# EAGLE design WiFi_Switch (EAGLE 9.3.1)
The Schematis for the WiFi Switch project.
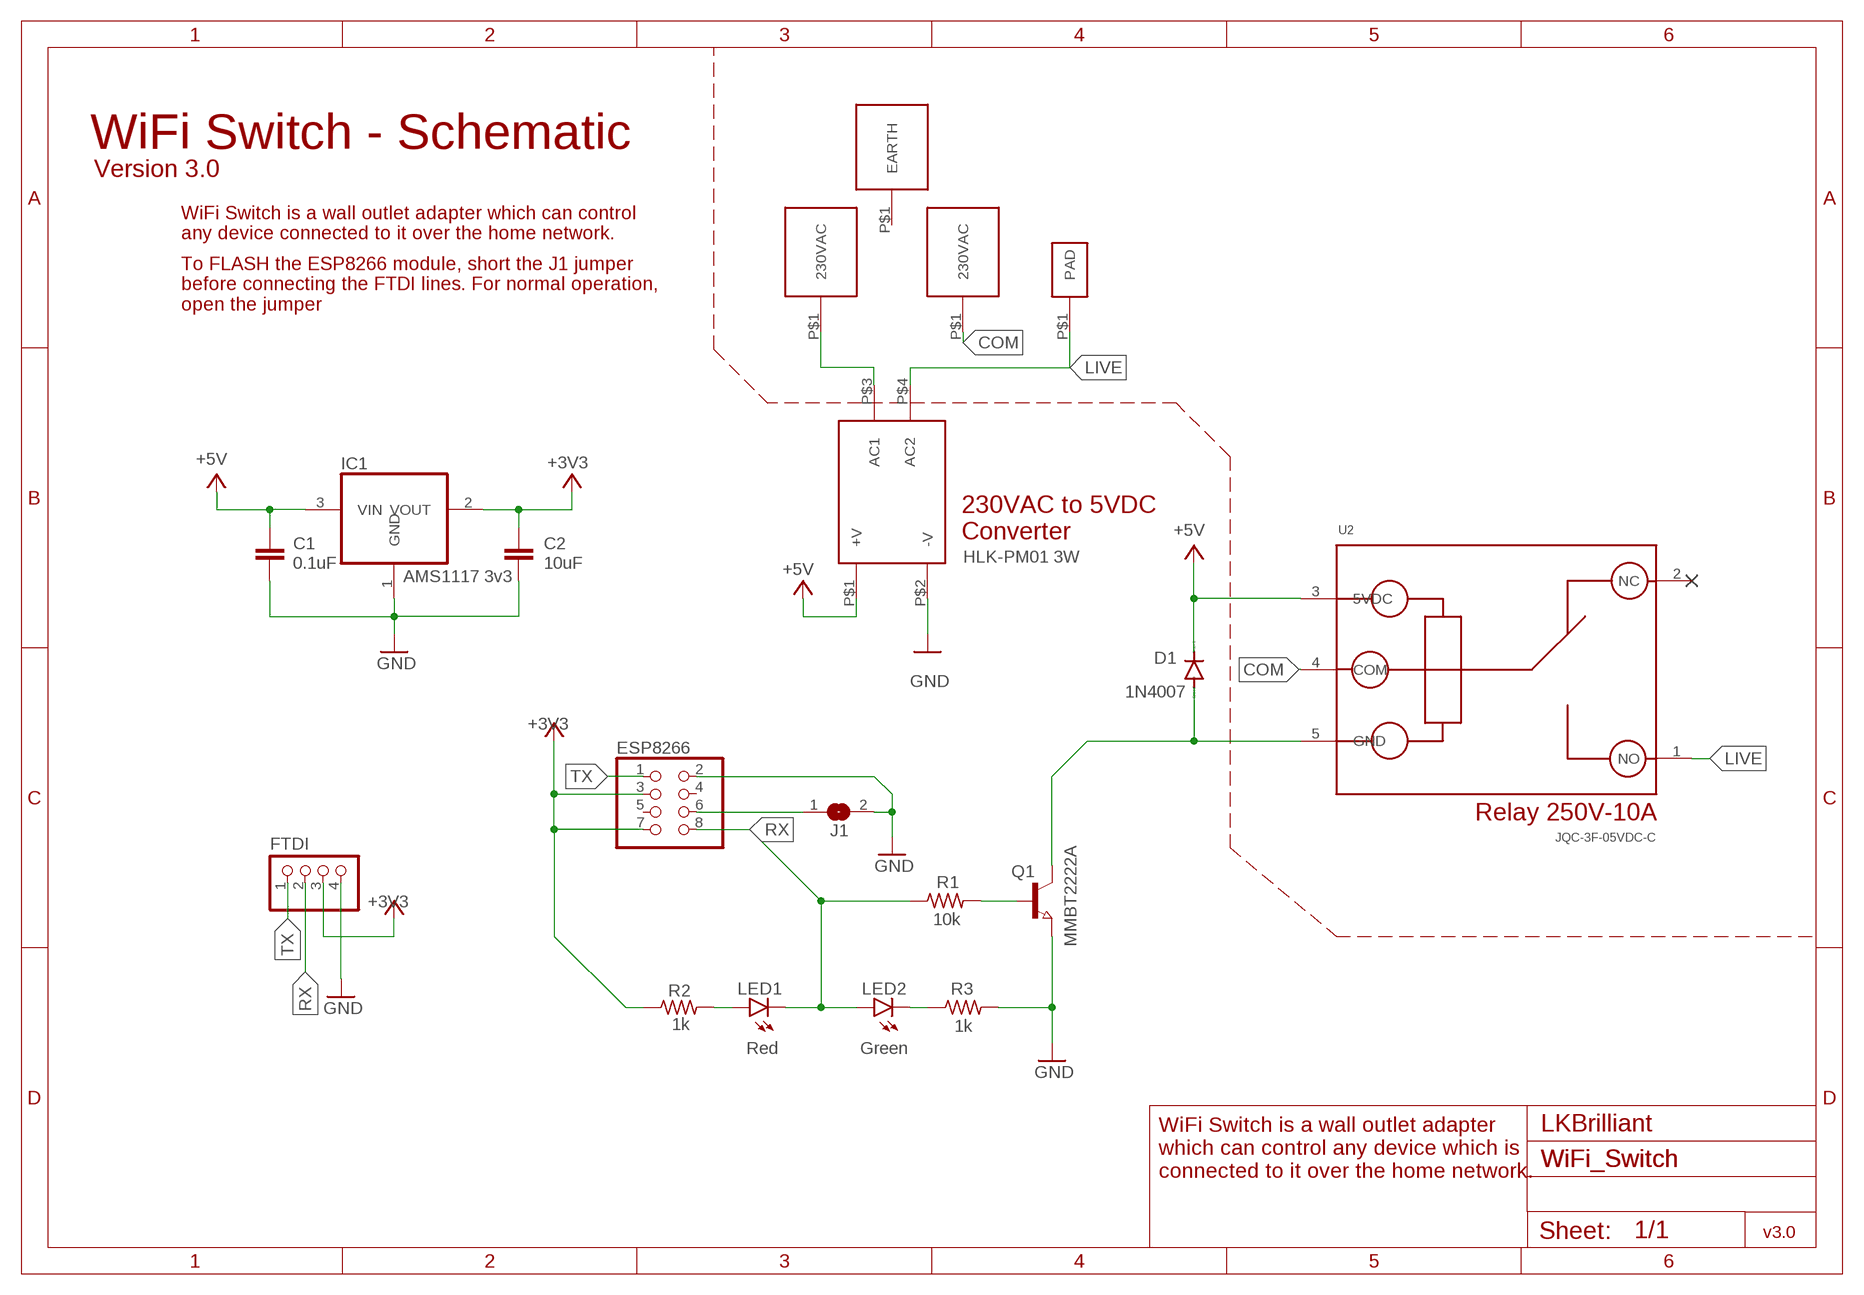
[diagram p0: schematic, sheet 1]

## Parts
C1  0.1uF  C-EUC0805  [C0805]
C2  10uF  C-EUC0805  [C0805]
D1  1N4007  DIODE-DO214AC  [DO214AC]
ESP8266  PINHD-2X4  [2X04]
FTDI  PINHD-1X4  [1X04]
IC1  AMS1117 3v3  REG1117  [SOT223]
J1  SJ  [SJ]
L  230VAC_PAD  [11X9_SMD_PAD]
LED1  Red  LEDCHIPLED_0603  [CHIPLED_0603]
LED2  Green  LEDCHIPLED_0603  [CHIPLED_0603]
N  230VAC_PAD  [11X9_SMD_PAD]
Q1  MMBT2222A  NPN-TRANSISTOR_SOT23  [SOT23]
R1  10k  R-US_R0805  [R0805]
R2  1k  R-US_R0805  [R0805]
R3  1k  R-US_R0805  [R0805]
U1  230VAC/5VDC_CONVERTER  [REG_BLOCK]
U2  JQC-3F-05VDC-C  RELAY-JQC-3F  [JQC-3F]
U$4  EARTH_PAD  [17X8_PAD]
U$5  EXT_PAD  [4X2_PAD]

## Nets
+3V3: C2.1 ESP8266.3 ESP8266.7 FTDI.3 IC1.2(VOUT) R2.1
+5V: C1.1 D1.C IC1.3(VIN) U1.P$1(+V) U2.3(5VDC)
COM: L.P$1(230VAC) U2.4(COM)
GND: C1.2 C2.2 ESP8266.2 FTDI.4 IC1.1(GND) J1.2 Q1.2(E) R3.2 U1.P$2(-V)
LIVE: U1.P$4(AC2) U2.1(NO) U$5.P$1(PAD)
N$1: LED1.A R2.2
N$2: N.P$1(230VAC) U1.P$3(AC1)
N$3: ESP8266.6 J1.1
N$5: D1.A Q1.3(C) U2.5(GND)
N$6: LED2.C R3.1
N$7: Q1.1(B) R1.2
RX: ESP8266.8 FTDI.2 LED1.C LED2.A R1.1
TX: ESP8266.1 FTDI.1
Unconnected: ESP8266.4 ESP8266.5 U2.2(NC) U$4.P$1(EARTH)

## Notes on the sheet
- WiFi Switch - Schematic
- Version 3.0
- WiFi Switch is a wall outlet adapter which can control
  any device connected to it over the home network.
- To FLASH the ESP8266 module, short the J1 jumper
  before connecting the FTDI lines. For normal operation,
  open the jumper
- 230VAC to 5VDC 
  Converter
- HLK-PM01 3W
- Relay 250V-10A
- LKBrilliant
- WiFi Switch is a wall outlet adapter 
  which can control any device which is
  connected to it over the home network.
- v3.0

## Library data of the parts
C1 C2 = rcl:C-EU: CAPACITOR, European symbol; SPICEPREFIX: C
D1 = diode:DIODE-: DIODE
ESP8266 = pinhead:PINHD-2X4: PIN HEADER
FTDI = pinhead:PINHD-1X4: PIN HEADER
IC1 = burr-brown:REG1117: 800mA and 1A Low Dropout (LDO) Positive Regulator 1.8V, 2.5V, 2.85V, 3.3V, 5V, and Adj; MPN: REG1117; OC_FARNELL: 1097566; OC_NEWARK: 14P6981
J1 = jumper:SJ: SMD solder JUMPER
L N = MyCustomLibrary:230VAC_PAD
LED1 LED2 = led:LED: LED OSRAM: - CHIPLED LG R971, LG N971, LY N971, LG Q971, LY Q971, LO R971, LY R971 LH N974, LH R974 LS Q976, LO Q976, LY Q976 LO Q996 - Hyper CHIPLED LW Q18S LB Q993, LB Q99A, LB R99A - SideLED LS A670, LO A670, LY A670, LG A670, LP A670 LB A673, LV A673, LT A673, LW A673 LH A674 LY A675 LS A676, LA A676, LO A676, LY A676, LW A676 LS A679, LY A679, LG A679 - Hyper Micro SIDELED® LS Y876, LA Y876, LO Y876, LY Y876 LT Y87S - SmartLED LW L88C, LW L88S LB L89C, LB L89S, LG L890 LS L89K, LO L89K, LY L89K LS L896, LA L896, LO L896, LY L896 - TOPLED LS T670, LO T670, LY T670, LG T670, LP T670 LSG T670, LSP T670, LSY T670, LOP T670, LYG T670 LG T671, LOG T671, LSG T671 LB T673, LV T673, LT T673, LW T673 LH T674 LS T676, LA T676, LO T676, LY T676, LB T676, LH T676, LSB T676, LW T676 LB T67C, LV T67C, LT T67C, LS T67K, LO T67K, LY T67K, LW E67C LS E67B, LA E67B, LO E67B, LY E67B, LB E67C, LV E67C, LT E67C LW T67C LS T679, LY T679, LG T679 LS T770, LO T770, LY T770, LG T770, LP T770 LB T773, LV T773, LT T773, LW T773 LH T774 LS E675, LA E675, LY E675, LS T675 LS T776, LA T776, LO T776, LY T776, LB T776 LHGB T686 LT T68C, LB T68C - Hyper Mini TOPLED® LB M676 - Mini TOPLED Santana® LG M470 LS M47K, LO M47K, LY M47K Source: http://www.osram.convergy.de LUXEON: - LUMILED® LXK2-PW12-R00, LXK2-PW12-S00, LXK2-PW14-U00, LXK2-PW14-V00 LXK2-PM12-R00, LXK2-PM12-S00, LXK2-PM14-U00 LXK2-PE12-Q00, LXK2-PE12-R00, LXK2-PE12-S00, LXK2-PE14-T00, LXK2-PE14-U00 LXK2-PB12-K00, LXK2-PB12-L00, LXK2-PB12-M00, LXK2-PB14-N00, LXK2-PB14-P00, LXK2-PB14-Q00 LXK2-PR12-L00, LXK2-PR12-M00, LXK2-PR14-Q00, LXK2-PR14-R00 LXK2-PD12-Q00, LXK2-PD12-R00, LXK2-PD12-S00 LXK2-PH12-R00, LXK2-PH12-S00 LXK2-PL12-P00, LXK2-PL12-Q00, LXK2-PL12-R00 Source: www.luxeon.com KINGBRIGHT: KA-3528ASYC Source: www.kingbright.com
Q1 = semicon-smd-ipc:NPN-TRANSISTOR_: NPN TRANSISTOR
R1-R3 = resistor:R-US_: RESISTOR, American symbol
U1 = MyCustomLibrary:230VAC/5VDC_CONVERTER
U2 = MyCustomLibrary:RELAY-JQC-3F
U$4 = MyCustomLibrary:EARTH_PAD
U$5 = MyCustomLibrary:EXT_PAD

## Board
The board layout for the WiFi Switch project.
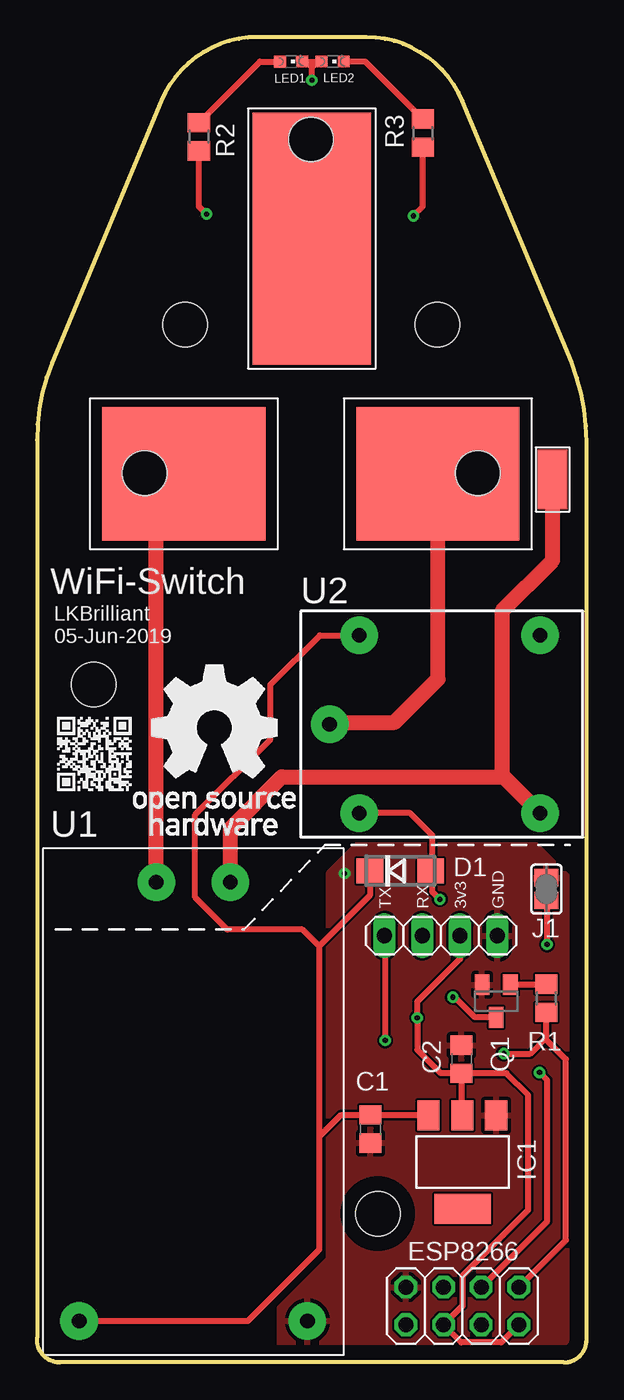
[diagram p1: board, top side]
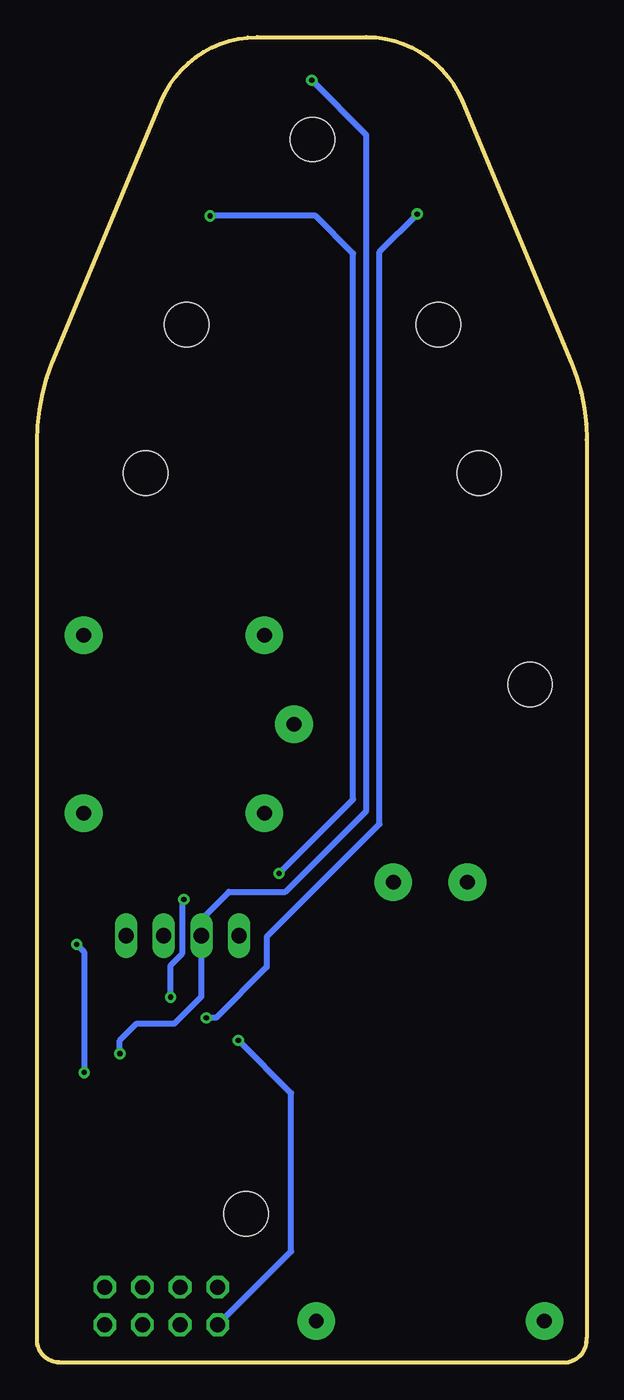
[diagram p2: board, bottom side, seen from below]

Size 37.09 x 89.41 mm. Coordinates in mm from the lower left corner, seen from the top.
Outline: 0,62.23 0,1.65 arc95 1.53,0 35.56,0 arc90 37.09,1.52 37.09,62.1 arc22 36.07,67.44 28.71,85.09 arc67 22.23,89.41 14.86,89.41 arc67 8.39,85.09 1.02,67.44 arc23 0,62.23
Copper layers (1*16): Top 0.035mm / dielectric 1.5mm / Bottom 0.035mm
Design rules "default": minimum track width 6mil, minimum drill 0.35mm, track to track 6mil, track to pad 6mil, pad to pad 6mil, via to via 6mil, smd to smd 6mil, copper to edge 40mil, drill to drill 6mil, minimum pad ring 10mil, minimum via ring 8mil, stop-mask expansion 4mil, vias tented up to drill 0mil, thermal gap 10mil
Holes 3 mm at 27,70 10,70 29.75,60 18.5,82.5 7.25,60 3.81,45.72 22.99,10.03

### Footprints (pad centres in the part's own frame; a part is rotated, then mirrored left to right if it is on the bottom)
C0805 = smd 1.3 x 1.5: 1 -0.95,0; 2 0.95,0
DO214AC = smd 1.8 x 1.7: A 2.05,0; C -2.05,0
2X04 = drill 1.016 octagon: 1 -3.81,-1.27; 2 -3.81,1.27; 3 -1.27,-1.27; 4 -1.27,1.27; 5 1.27,-1.27; 6 1.27,1.27; 7 3.81,-1.27; 8 3.81,1.27
1X04 = drill 1.016 long: 1 -3.81,0; 2 -1.27,0; 3 1.27,0; 4 3.81,0
SOT223 = smd 1.499 x 2.007: 1 -2.261,-3.15; 2 0.025,-3.15; 3 2.311,-3.15 | smd 3.81 x 2.007: 4 0,3.15
SJ = smd 1.168 x 1.6: 1 -0.762,0; 2 0.762,0
11X9_SMD_PAD = smd 11 x 9: P$1 0,0
CHIPLED_0603 = smd 0.8 x 0.8: A 0,-0.75; C 0,0.75
SOT23 = smd 1 x 1.4: 1 -0.95,-1.1; 2 0.95,-1.1; 3 0,1.1
R0805 = smd 1.3 x 1.5: 1 -0.95,0; 2 0.95,0
REG_BLOCK = drill 1 pad 2.54: P$1 -7.7,-14.6; P$2 7.7,-14.6; P$3 -2.5,15; P$4 2.5,15
JQC-3F = drill 1 pad 2.54: 1 -6,-6; 2 6,-6; 3 6,6.2; 4 0,8.2; 5 -6,6.2
17X8_PAD = smd 17 x 8: P$1 0,0
4X2_PAD = smd 4 x 2: P$1 0,0

### Placement (x,y rotation side)
C1  22.5,15.75 270 top
C2  28.64,20.45 90 top
D1  24.52,33.15 0 top
ESP8266  28.71,3.81 0 top
FTDI  27.27,28.79 0 top
IC1  28.73,13.52 180 top
J1  34.38,31.93 90 top
L  27.06,59.94 0 top
LED1  17.15,87.76 270.8 top
LED2  19.94,87.76 270 top
N  9.91,59.94 0 top
Q1  30.99,24.38 180 top
R1  34.36,24.57 90 top
R2  10.93,82.68 90 top
R3  26.04,82.93 270 top
U1  10.55,17.4 0 top
U2  27.94,43.05 90 top
U$4  18.55,75.82 90 top
U$5  34.8,59.56 90 top

### Tracks (layer width: path | path; a pad name or v marks a point on that pad's centre or on a via)
+3V3  (via drill 0.35)
  Top 0.406: ESP8266.7 31.32,1.35 28.63,1.35 ESP8266.3 28.71,3.81 28.71,5.84 33.15,10.29 33.15,18.03 31.68,19.5 C2.1 | C2.1 27.24,19.5 25.66,21.09 v25.66,23.25 25.66,24.34 28.54,27.22 FTDI.3 | C2.1 28.64,16.73 IC1.2 | v11.43,77.47 10.93,77.98 R2.1
  Bottom 0.406: v11.43,77.47 13.97,74.93 13.97,36.32 21.59,28.7 21.59,26.67 25.01,23.25 v25.66,23.25
+5V
  Top 0.406: U1.P$1 14.23,2.8 19.05,7.62 19.05,15.24 | 19.05,15.24 20.52,16.7 C1.1 22.54,16.67 IC1.3 26.38,16.7 26.38,17.01 | D1.C 22.47,31.5 19.05,28.09 19.05,28.07 | 19.05,28.07 17.91,29.21 12.83,29.21 10.67,31.37 10.67,36.96 15.75,42.04 15.75,45.72 19.09,49.05 U2.3 | 19.05,15.24 19.05,28.07
COM
  Top 0.406: L.P$1 26.73,59.94
  Top 1.016: U2.4 19.87,43.18 24.13,43.18 27.06,46.1 27.06,58.42 26.73,58.75 26.73,59.94
GND  (via drill 0.35)
  Top 0.406: v25.4,77.34 26.04,77.98 R3.2
  Bottom 0.406: v25.4,77.34 18.29,77.34 15.75,74.8 15.75,37.99 v20.76,32.98
  pour Top: 16.39,-1.27 16.39,3.68 19.69,6.99 19.69,33.02 21.59,34.92 33.66,34.92 38.1,30.48 38.1,-1.27
LIVE
  Top 1.016: U1.P$4 13.05,36.03 16.51,39.5 31.5,39.5 U2.1 31.37,39.62 31.37,50.67 34.8,54.1 U$5.P$1
N$1
  Top 0.406: 11.43,84.14 R2.2 15.05,87.75 LED1.A
N$2
  Top 1.016: U1.P$3 8.05,56.3 10.28,58.53 10.28,59.58 N.P$1
N$3  (via drill 0.35)
  Top 0.406: v34.42,28.19 34.42,31.12 J1.1 | v33.91,19.56 34.42,19.05 34.42,9.53 ESP8266.6
  Bottom 0.406: v34.42,28.19 33.91,27.69 v33.91,19.56
N$5  (via drill 0.35)
  Top 0.406: 26.67,33.26 D1.A 26.67,33.15 26.67,31.75 v27.18,31.24 | 26.67,33.26 26.67,35.56 25.18,37.05 U2.5 | 26.67,33.26 27.03,32.9 | Q1.3 29.55,23.28 28.2,24.64 v28.07,24.64
  Bottom 0.406: v28.07,24.64 28.07,26.8 27.31,27.56 27.31,31.11 v27.18,31.24
N$6
  Top 0.406: R3.1 22.16,87.76 LED2.C
N$7
  Top 0.406: R1.2 34.33,25.48 Q1.1
RX  (via drill 0.35)
  Top 0.406: LED1.C 17.91,87.76 18.17,87.76 | 18.17,87.76 18.93,87.76 | 18.93,87.76 LED2.A | 18.55,87.38 18.93,87.76 | v18.55,86.49 18.55,87.38 | 18.55,87.38 18.17,87.76 | v31.5,20.83 33.28,20.83 34.36,21.91 R1.1 34.36,21.77 35.69,20.45 35.69,8.26 ESP8266.8
  Bottom 0.406: v18.55,86.49 14.86,82.8 14.86,37.21 20.32,31.75 24.13,31.75 26,29.89 FTDI.2 26,24.68 27.82,22.86 30.36,22.86 31.5,21.72 v31.5,20.83
TX  (via drill 0.35)
  Top 0.406: v23.5,21.72 23.5,28.75 FTDI.1
  Bottom 0.406: ESP8266.1 19.94,7.49 19.94,18.16 v23.5,21.72

### Text on the board
tPlace: LKBrilliant / 05-Jun-2019 | TX | RX | 3v3 | GND
tNames: WiFi-Switch